# EAGLE schematic vending-machine-v2-knob-board-r1 (EAGLE 5.11)
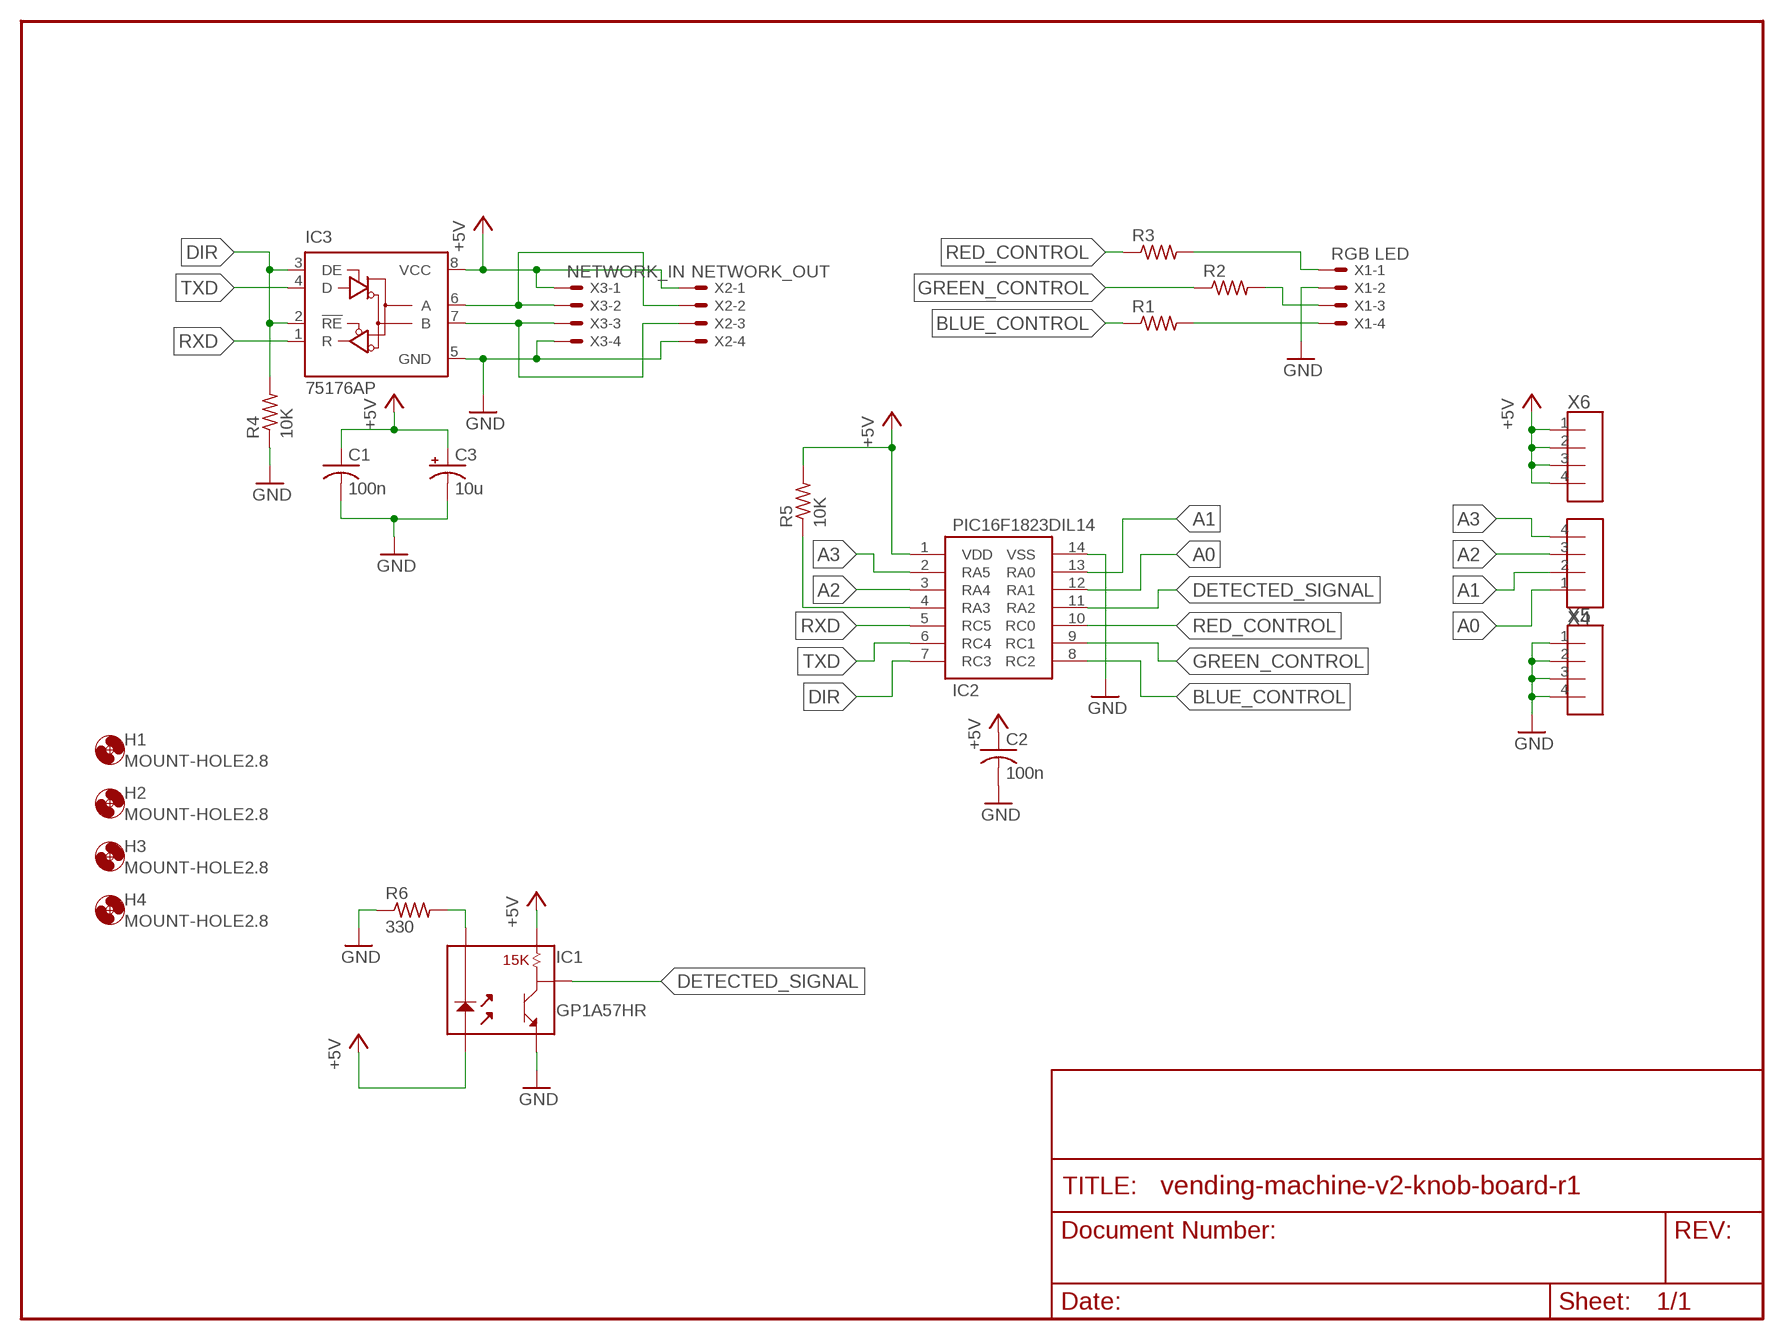
[diagram p0: schematic, sheet 1]

## Parts
C1  100n  C-US025-025X050  [C025-025X050]
C2  100n  C-US025-025X050  [C025-025X050]
C3  10u  CPOL-USE2-5  [E2-5]
H1  MOUNT-HOLE2.8  [2,8]
H2  MOUNT-HOLE2.8  [2,8]
H3  MOUNT-HOLE2.8  [2,8]
H4  MOUNT-HOLE2.8  [2,8]
IC1  GP1A57HR  [GP1A57HR]
IC2  PIC16F1823DIL14  [DIP14]
IC3  75176AP  [DIL08]
R1  R-US_0207/2V  [0207/2V]
R2  R-US_0207/2V  [0207/2V]
R3  R-US_0207/2V  [0207/2V]
R4  10K  R-US_0207/7  [0207/7]
R5  10K  R-US_0207/7  [0207/7]
R6  330  R-US_0207/2V  [0207/2V]
X1  RGB LED  22-23-2041  [22-23-2041]
X2  NETWORK_OUT  22-23-2041  [22-23-2041]
X3  NETWORK_IN  22-23-2041  [22-23-2041]
X4  M04-100MIL  [100MIL-4]
X5  M04-100MIL  [100MIL-4]
X6  M04-100MIL  [100MIL-4]

## Nets
+5V: C1.1 C2.1 C3.+ IC1.1 IC1.3 IC2.1(VDD) IC3.8(VCC) R5.2 X2.1 X3.1 X6.1 X6.2 X6.3 X6.4
A0: IC2.12(RA1) X4.1
A1: IC2.13(RA0) X4.2
A2: IC2.3(RA4) X4.3
A3: IC2.2(RA5) X4.4
BLUE_CONTROL: IC2.8(RC2) R1.1
DETECTED_SIGNAL: IC1.4 IC2.11(RA2)
DIR: IC2.7(RC3) IC3.2(!RE) IC3.3(DE) R4.2
GND: C1.2 C2.2 C3.- IC1.5 IC2.14(VSS) IC3.5(GND) R4.1 R6.1 X1.2 X2.4 X3.4 X5.1 X5.2 X5.3 X5.4
GREEN_CONTROL: IC2.9(RC1) R2.1
N$1: R3.2 X1.1
N$2: R2.2 X1.3
N$3: R1.2 X1.4
N$4: IC3.7(B) X2.3 X3.3
N$5: IC3.6(A) X2.2 X3.2
N$6: IC2.4(RA3) R5.1
N$8: IC1.2 R6.2
RED_CONTROL: IC2.10(RC0) R3.1
RXD: IC2.5(RC5) IC3.1(R)
TXD: IC2.6(RC4) IC3.4(D)

## Library data of the parts
C1 C2 = rcl:C-US: CAPACITOR, American symbol
C3 = rcl:CPOL-US: POLARIZED CAPACITOR, American symbol
H1-H4 = holes:MOUNT-HOLE: MOUNTING HOLE with drill center marker
IC1 = SparkFun:GP1A57HR
IC2 = dp_devices:PIC16F1823
IC3 = 751xx:75176A: DIFFERENTIAL BUS TRANSCEIVER Source: http://focus.ti.com/lit/ds/symlink/sn75176a.pdf
R1-R6 = rcl:R-US_: RESISTOR, American symbol
X1-X3 = con-molex:22-23-2041: .100" (2.54mm) Center Header - 4 Pin; MF: MOLEX; MPN: 22-23-2041; OC_FARNELL: 1462920; OC_NEWARK: 38C0355
X4-X6 = rbg-generic-headers:M04-100MIL